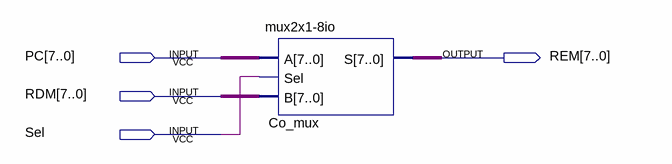
[diagram p0: schematic sheet]
// Quartus schematic mux.bdf as structural Verilog: 1 symbols, 4 pins
module mux (
  input  [7:0] PC,
  input  [7:0] RDM,
  input  Sel,
  output [7:0] REM
);

  \mux2x1-8io  Co_mux (.A(PC), .Sel(Sel), .B(RDM), .S(REM));
endmodule
